# EAGLE design relay_module (EAGLE 6.3)
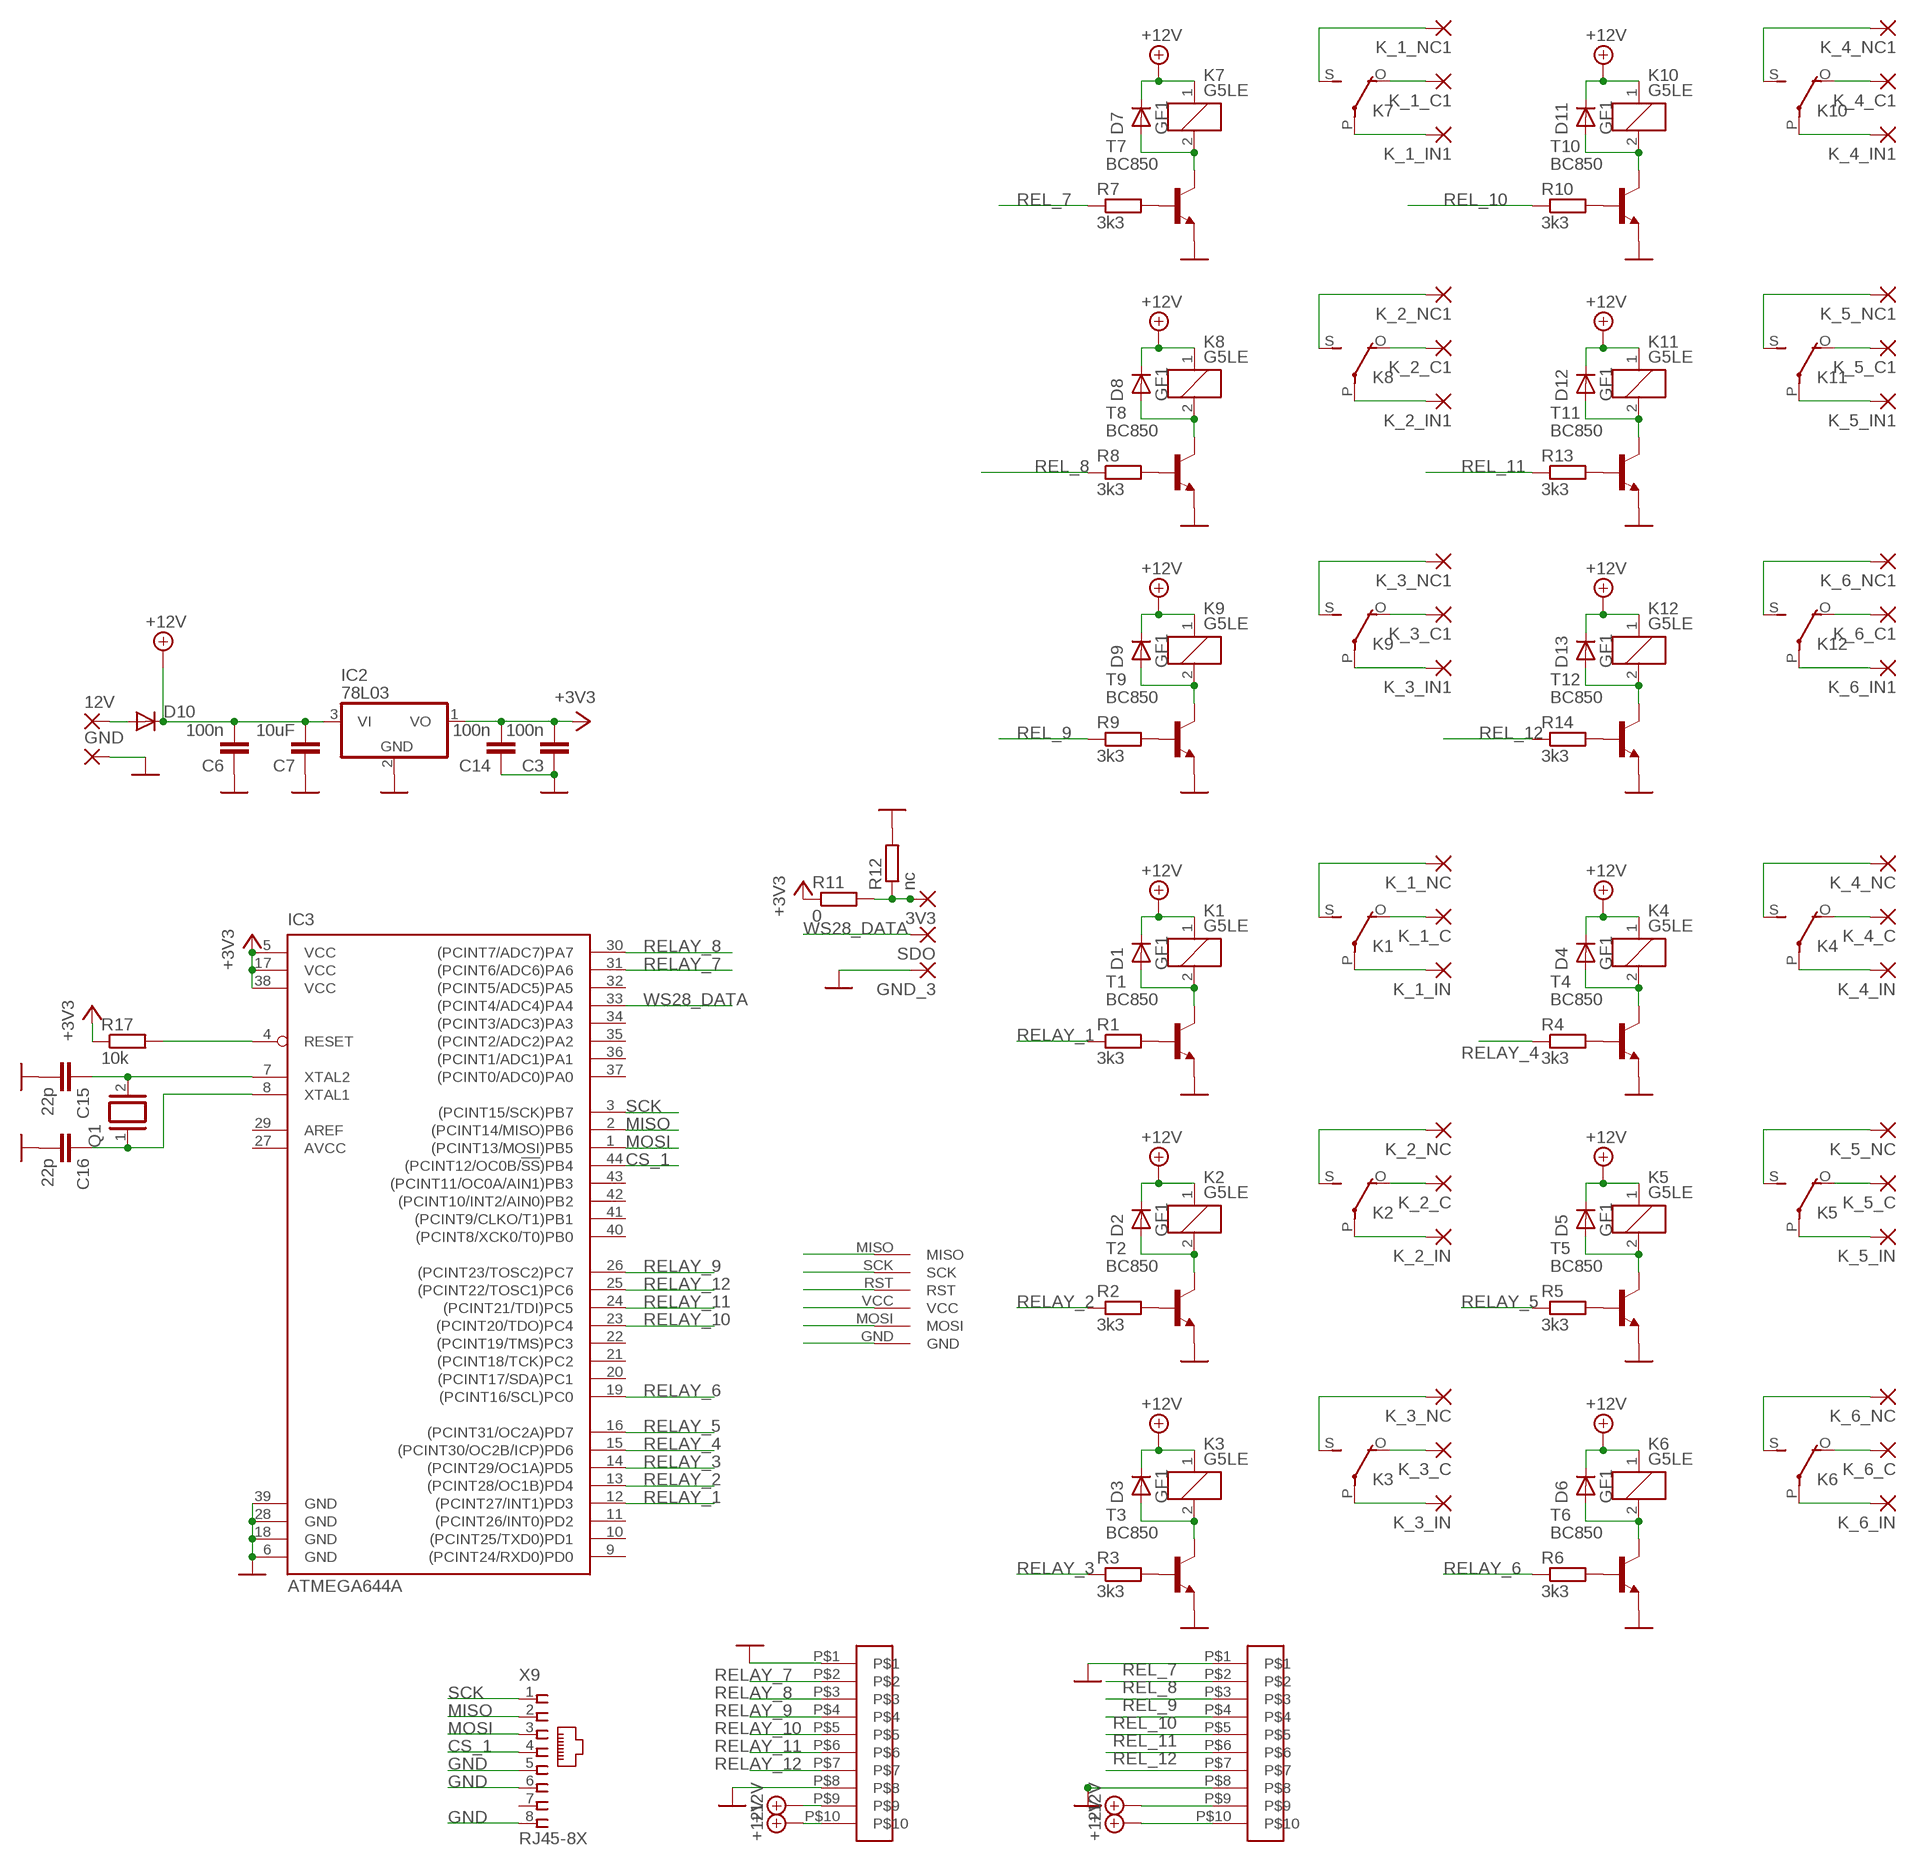
[diagram p0: schematic, sheet 1]

## Parts
3V3  2,15/1,0  [2,15/1,0]
12V  2,54/0,8  [2,54/0,8]
C3  100n  C-EUC1206  [C1206]
C6  100n  C-EUC1206  [C1206]
C7  10uF  C-EUC1206  [C1206]
C14  100n  C-EUC1206  [C1206]
C15  22p  C-EUC1206  [C1206]
C16  22p  C-EUC1206  [C1206]
D1  GF1  [SMA-DO214AC]
D2  GF1  [SMA-DO214AC]
D3  GF1  [SMA-DO214AC]
D4  GF1  [SMA-DO214AC]
D5  GF1  [SMA-DO214AC]
D6  GF1  [SMA-DO214AC]
D7  GF1  [SMA-DO214AC]
D8  GF1  [SMA-DO214AC]
D9  GF1  [SMA-DO214AC]
D10  1N4148DO35-10  [DO35-10]
D11  GF1  [SMA-DO214AC]
D12  GF1  [SMA-DO214AC]
D13  GF1  [SMA-DO214AC]
GND  2,54/0,8  [2,54/0,8]
GND_3  2,15/1,0  [2,15/1,0]
IC2  78L03  78L05Z  [TO92]
IC3  ATMEGA644A  [TQFP44]
K1  G5LE  [G5LE]
K2  G5LE  [G5LE]
K3  G5LE  [G5LE]
K4  G5LE  [G5LE]
K5  G5LE  [G5LE]
K6  G5LE  [G5LE]
K7  G5LE  [G5LE]
K8  G5LE  [G5LE]
K9  G5LE  [G5LE]
K10  G5LE  [G5LE]
K11  G5LE  [G5LE]
K12  G5LE  [G5LE]
K_1_C  2,54/0,8  [2,54/0,8]
K_1_C1  2,54/0,8  [2,54/0,8]
K_1_IN  2,54/0,8  [2,54/0,8]
K_1_IN1  2,54/0,8  [2,54/0,8]
K_1_NC  2,54/0,8  [2,54/0,8]
K_1_NC1  2,54/0,8  [2,54/0,8]
K_2_C  2,54/0,8  [2,54/0,8]
K_2_C1  2,54/0,8  [2,54/0,8]
K_2_IN  2,54/0,8  [2,54/0,8]
K_2_IN1  2,54/0,8  [2,54/0,8]
K_2_NC  2,54/0,8  [2,54/0,8]
K_2_NC1  2,54/0,8  [2,54/0,8]
K_3_C  2,54/0,8  [2,54/0,8]
K_3_C1  2,54/0,8  [2,54/0,8]
K_3_IN  2,54/0,8  [2,54/0,8]
K_3_IN1  2,54/0,8  [2,54/0,8]
K_3_NC  2,54/0,8  [2,54/0,8]
K_3_NC1  2,54/0,8  [2,54/0,8]
K_4_C  2,54/0,8  [2,54/0,8]
K_4_C1  2,54/0,8  [2,54/0,8]
K_4_IN  2,54/0,8  [2,54/0,8]
K_4_IN1  2,54/0,8  [2,54/0,8]
K_4_NC  2,54/0,8  [2,54/0,8]
K_4_NC1  2,54/0,8  [2,54/0,8]
K_5_C  2,54/0,8  [2,54/0,8]
K_5_C1  2,54/0,8  [2,54/0,8]
K_5_IN  2,54/0,8  [2,54/0,8]
K_5_IN1  2,54/0,8  [2,54/0,8]
K_5_NC  2,54/0,8  [2,54/0,8]
K_5_NC1  2,54/0,8  [2,54/0,8]
K_6_C  2,54/0,8  [2,54/0,8]
K_6_C1  2,54/0,8  [2,54/0,8]
K_6_IN  2,54/0,8  [2,54/0,8]
K_6_IN1  2,54/0,8  [2,54/0,8]
K_6_NC  2,54/0,8  [2,54/0,8]
K_6_NC1  2,54/0,8  [2,54/0,8]
Q1  XTAL/S  [QS]
R1  3k3  R-EU_M3216  [M3216]
R2  3k3  R-EU_M3216  [M3216]
R3  3k3  R-EU_M3216  [M3216]
R4  3k3  R-EU_M3216  [M3216]
R5  3k3  R-EU_M3216  [M3216]
R6  3k3  R-EU_M3216  [M3216]
R7  3k3  R-EU_M3216  [M3216]
R8  3k3  R-EU_M3216  [M3216]
R9  3k3  R-EU_M3216  [M3216]
R10  3k3  R-EU_M3216  [M3216]
R11  0  R-EU_M3216  [M3216]
R12  nc  R-EU_M3216  [M3216]
R13  3k3  R-EU_M3216  [M3216]
R14  3k3  R-EU_M3216  [M3216]
R17  10k  R-EU_M3216  [M3216]
SDO  2,15/1,0  [2,15/1,0]
T1  BC850  [SOT23]
T2  BC850  [SOT23]
T3  BC850  [SOT23]
T4  BC850  [SOT23]
T5  BC850  [SOT23]
T6  BC850  [SOT23]
T7  BC850  [SOT23]
T8  BC850  [SOT23]
T9  BC850  [SOT23]
T10  BC850  [SOT23]
T11  BC850  [SOT23]
T12  BC850  [SOT23]
U$1  10P  [10P]
U$2  AVR_ISP  [AVR_ISP]
U$3  10P  [10P]
X9  RJ45-8X  [RJ45-NO-SHIELD]

## Nets
+3V3: C3.2 C14.2 IC2.1(VO) IC3.5(VCC) IC3.17(VCC) IC3.38(VCC) R11.1 R17.1 U$2.VCC
+12V: C6.2 C7.2 D1.K(C) D2.K(C) D3.K(C) D4.K(C) D5.K(C) D6.K(C) D7.K(C) D8.K(C) D9.K(C) D10.C D11.K(C) D12.K(C) D13.K(C) IC2.3(VI) K1.1 K2.1 K3.1 K4.1 K5.1 K6.1 K7.1 K8.1 K9.1 K10.1 K11.1 K12.1 U$1.P$9 U$1.P$10 U$3.P$9 U$3.P$10
CS_1: IC3.44((PCINT12/OC0B/!SS!)PB4) X9.4
GND: C3.1 C6.1 C7.1 C14.1 C15.2 C16.2 GND.1(P) GND_3.1(P) IC2.2(GND) IC3.6(GND) IC3.18(GND) IC3.28(GND) IC3.39(GND) R12.2 T1.2(E) T2.2(E) T3.2(E) T4.2(E) T5.2(E) T6.2(E) T7.2(E) T8.2(E) T9.2(E) T10.2(E) T11.2(E) T12.2(E) U$1.P$1 U$1.P$8 U$2.GND U$3.P$1 U$3.P$8 X9.5 X9.6 X9.8
MISO: IC3.2((PCINT14/MISO)PB6) U$2.MISO X9.2
MOSI: IC3.1((PCINT13/MOSI)PB5) U$2.MOSI X9.3
N$1: R1.2 T1.1(B)
N$2: D1.A K1.2 T1.3(C)
N$3: K1.S(2:S) K_1_NC.1(P)
N$4: K1.P(2:P) K_1_IN.1(P)
N$5: K1.O(2:O) K_1_C.1(P)
N$6: R2.2 T2.1(B)
N$7: D2.A K2.2 T2.3(C)
N$8: K2.P(2:P) K_2_IN.1(P)
N$9: K2.O(2:O) K_2_C.1(P)
N$10: K2.S(2:S) K_2_NC.1(P)
N$11: R3.2 T3.1(B)
N$12: D3.A K3.2 T3.3(C)
N$13: K3.P(2:P) K_3_IN.1(P)
N$14: K3.O(2:O) K_3_C.1(P)
N$15: K3.S(2:S) K_3_NC.1(P)
N$16: R4.2 T4.1(B)
N$17: D4.A K4.2 T4.3(C)
N$18: K4.P(2:P) K_4_IN.1(P)
N$19: K4.O(2:O) K_4_C.1(P)
N$20: K4.S(2:S) K_4_NC.1(P)
N$21: R5.2 T5.1(B)
N$22: D5.A K5.2 T5.3(C)
N$23: K5.P(2:P) K_5_IN.1(P)
N$24: K5.O(2:O) K_5_C.1(P)
N$25: K5.S(2:S) K_5_NC.1(P)
N$26: R6.2 T6.1(B)
N$27: D6.A K6.2 T6.3(C)
N$28: K6.P(2:P) K_6_IN.1(P)
N$29: K6.O(2:O) K_6_C.1(P)
N$30: K6.S(2:S) K_6_NC.1(P)
N$35: R7.2 T7.1(B)
N$36: D7.A K7.2 T7.3(C)
N$37: K7.P(2:P) K_1_IN1.1(P)
N$38: K7.O(2:O) K_1_C1.1(P)
N$39: K7.S(2:S) K_1_NC1.1(P)
N$40: R8.2 T8.1(B)
N$41: D8.A K8.2 T8.3(C)
N$42: K8.P(2:P) K_2_IN1.1(P)
N$43: K8.O(2:O) K_2_C1.1(P)
N$44: K8.S(2:S) K_2_NC1.1(P)
N$45: R9.2 T9.1(B)
N$46: D9.A K9.2 T9.3(C)
N$47: K9.P(2:P) K_3_IN1.1(P)
N$48: K9.O(2:O) K_3_C1.1(P)
N$49: K9.S(2:S) K_3_NC1.1(P)
N$50: 3V3.1(P) R11.2 R12.1
N$51: R10.2 T10.1(B)
N$52: D11.A K10.2 T10.3(C)
N$53: K10.P(2:P) K_4_IN1.1(P)
N$54: 12V.1(P) D10.A
N$55: K10.O(2:O) K_4_C1.1(P)
N$56: K10.S(2:S) K_4_NC1.1(P)
N$57: R13.2 T11.1(B)
N$58: D12.A K11.2 T11.3(C)
N$59: K11.P(2:P) K_5_IN1.1(P)
N$60: K11.O(2:O) K_5_C1.1(P)
N$61: C15.1 IC3.7(XTAL2) Q1.2
N$62: K11.S(2:S) K_5_NC1.1(P)
N$63: R14.2 T12.1(B)
N$64: D13.A K12.2 T12.3(C)
N$65: K12.P(2:P) K_6_IN1.1(P)
N$66: K12.O(2:O) K_6_C1.1(P)
N$67: K12.S(2:S) K_6_NC1.1(P)
N$79: C16.1 IC3.8(XTAL1) Q1.1
REL_7: R7.1 U$3.P$2
REL_8: R8.1 U$3.P$3
REL_9: R9.1 U$3.P$4
REL_10: R10.1 U$3.P$5
REL_11: R13.1 U$3.P$6
REL_12: R14.1 U$3.P$7
RELAY_1: IC3.12((PCINT27/INT1)PD3) R1.1
RELAY_2: IC3.13((PCINT28/OC1B)PD4) R2.1
RELAY_3: IC3.14((PCINT29/OC1A)PD5) R3.1
RELAY_4: IC3.15((PCINT30/OC2B/ICP)PD6) R4.1
RELAY_5: IC3.16((PCINT31/OC2A)PD7) R5.1
RELAY_6: IC3.19((PCINT16/SCL)PC0) R6.1
RELAY_7: IC3.31((PCINT6/ADC6)PA6) U$1.P$2
RELAY_8: IC3.30((PCINT7/ADC7)PA7) U$1.P$3
RELAY_9: IC3.26((PCINT23/TOSC2)PC7) U$1.P$4
RELAY_10: IC3.23((PCINT20/TDO)PC4) U$1.P$5
RELAY_11: IC3.24((PCINT21/TDI)PC5) U$1.P$6
RELAY_12: IC3.25((PCINT22/TOSC1)PC6) U$1.P$7
RESET: IC3.4(RESET) R17.2 U$2.RST
SCK: IC3.3((PCINT15/SCK)PB7) U$2.SCK X9.1
WS28_DATA: IC3.33((PCINT4/ADC4)PA4) SDO.1(P)
Unconnected: IC3.9((PCINT24/RXD0)PD0) IC3.10((PCINT25/TXD0)PD1) IC3.11((PCINT26/INT0)PD2) IC3.20((PCINT17/SDA)PC1) IC3.21((PCINT18/TCK)PC2) IC3.22((PCINT19/TMS)PC3) IC3.29(AREF) IC3.32((PCINT5/ADC5)PA5) IC3.34((PCINT3/ADC3)PA3) IC3.35((PCINT2/ADC2)PA2) IC3.36((PCINT1/ADC1)PA1) IC3.37((PCINT0/ADC0)PA0) IC3.40((PCINT8/XCK0/T0)PB0) IC3.41((PCINT9/CLKO/T1)PB1) IC3.42((PCINT10/INT2/AIN0)PB2) IC3.43((PCINT11/OC0A/AIN1)PB3) X9.7

## Power pins joined to a net without a drawn wire
AVCC: IC3.27(AVCC)

## Library data of the parts
3V3 GND_3 SDO = wirepad:2,15/1,0: THROUGH-HOLE PAD
12V GND K_1_C K_1_C1 K_1_IN K_1_IN1 K_1_NC K_1_NC1 K_2_C K_2_C1 K_2_IN K_2_IN1 K_2_NC K_2_NC1 K_3_C K_3_C1 K_3_IN K_3_IN1 K_3_NC K_3_NC1 K_4_C K_4_C1 K_4_IN K_4_IN1 K_4_NC K_4_NC1 K_5_C K_5_C1 K_5_IN K_5_IN1 K_5_NC K_5_NC1 K_6_C K_6_C1 K_6_IN K_6_IN1 K_6_NC K_6_NC1 = wirepad:2,54/0,8: THROUGH-HOLE PAD
C3 C6 C7 C14-C16 = resistor:C-EU: CAPACITOR, European symbol
D1-D9 D11-D13 = diode:GF1: DIODE
D10 = diode:1N4148: DIODE high speed (Philips)
IC2 = linear:78*: Positive VOLTAGE REGULATOR Source: http://cache.national.com/ds/LM/LM78L05.pdf http://www.fairchildsemi.com/ds/LM/LM7805.pdf
IC3 = atmel:ATMEGA644: 8-bit Microcontroller with 64K Bytes In-System Programmable Flash Source: http://www.atmel.com/dyn/resources/prod_documents/doc2593.pdf; MPN: ATMEGA644PV-10AU; OC_FARNELL: 1455123; OC_NEWARK: 58M3748
K1-K12 = relay:G5LE: RELAY 1 x switch, 10 A/120 V AC, 8 A/30 V DC, Omron; OC_FARNELL: unknown; OC_NEWARK: unknown
Q1 = special:XTAL/S: CRYSTAL
R1-R14 R17 = rcl:R-EU_: RESISTOR, European symbol
T1-T12 = transistor:BC850: NPN TRANSISTOR
U$1 U$3 = 2 - csatlakozo:10P
U$2 = 2 - csatlakozo:AVR_ISP
X9 = con-tycoelectronics:RJ45: CORCOM Modular RJ Jacks No Shield Source: www.tycoelectronics.com .. ENG_DS_1654001_1099_RJ_L_0507.pdf; MPN: RJ45-8X; OC_FARNELL: unknown; OC_NEWARK: 16R6101

## Net classes
0 default: clearance 0.355 mm

## Board
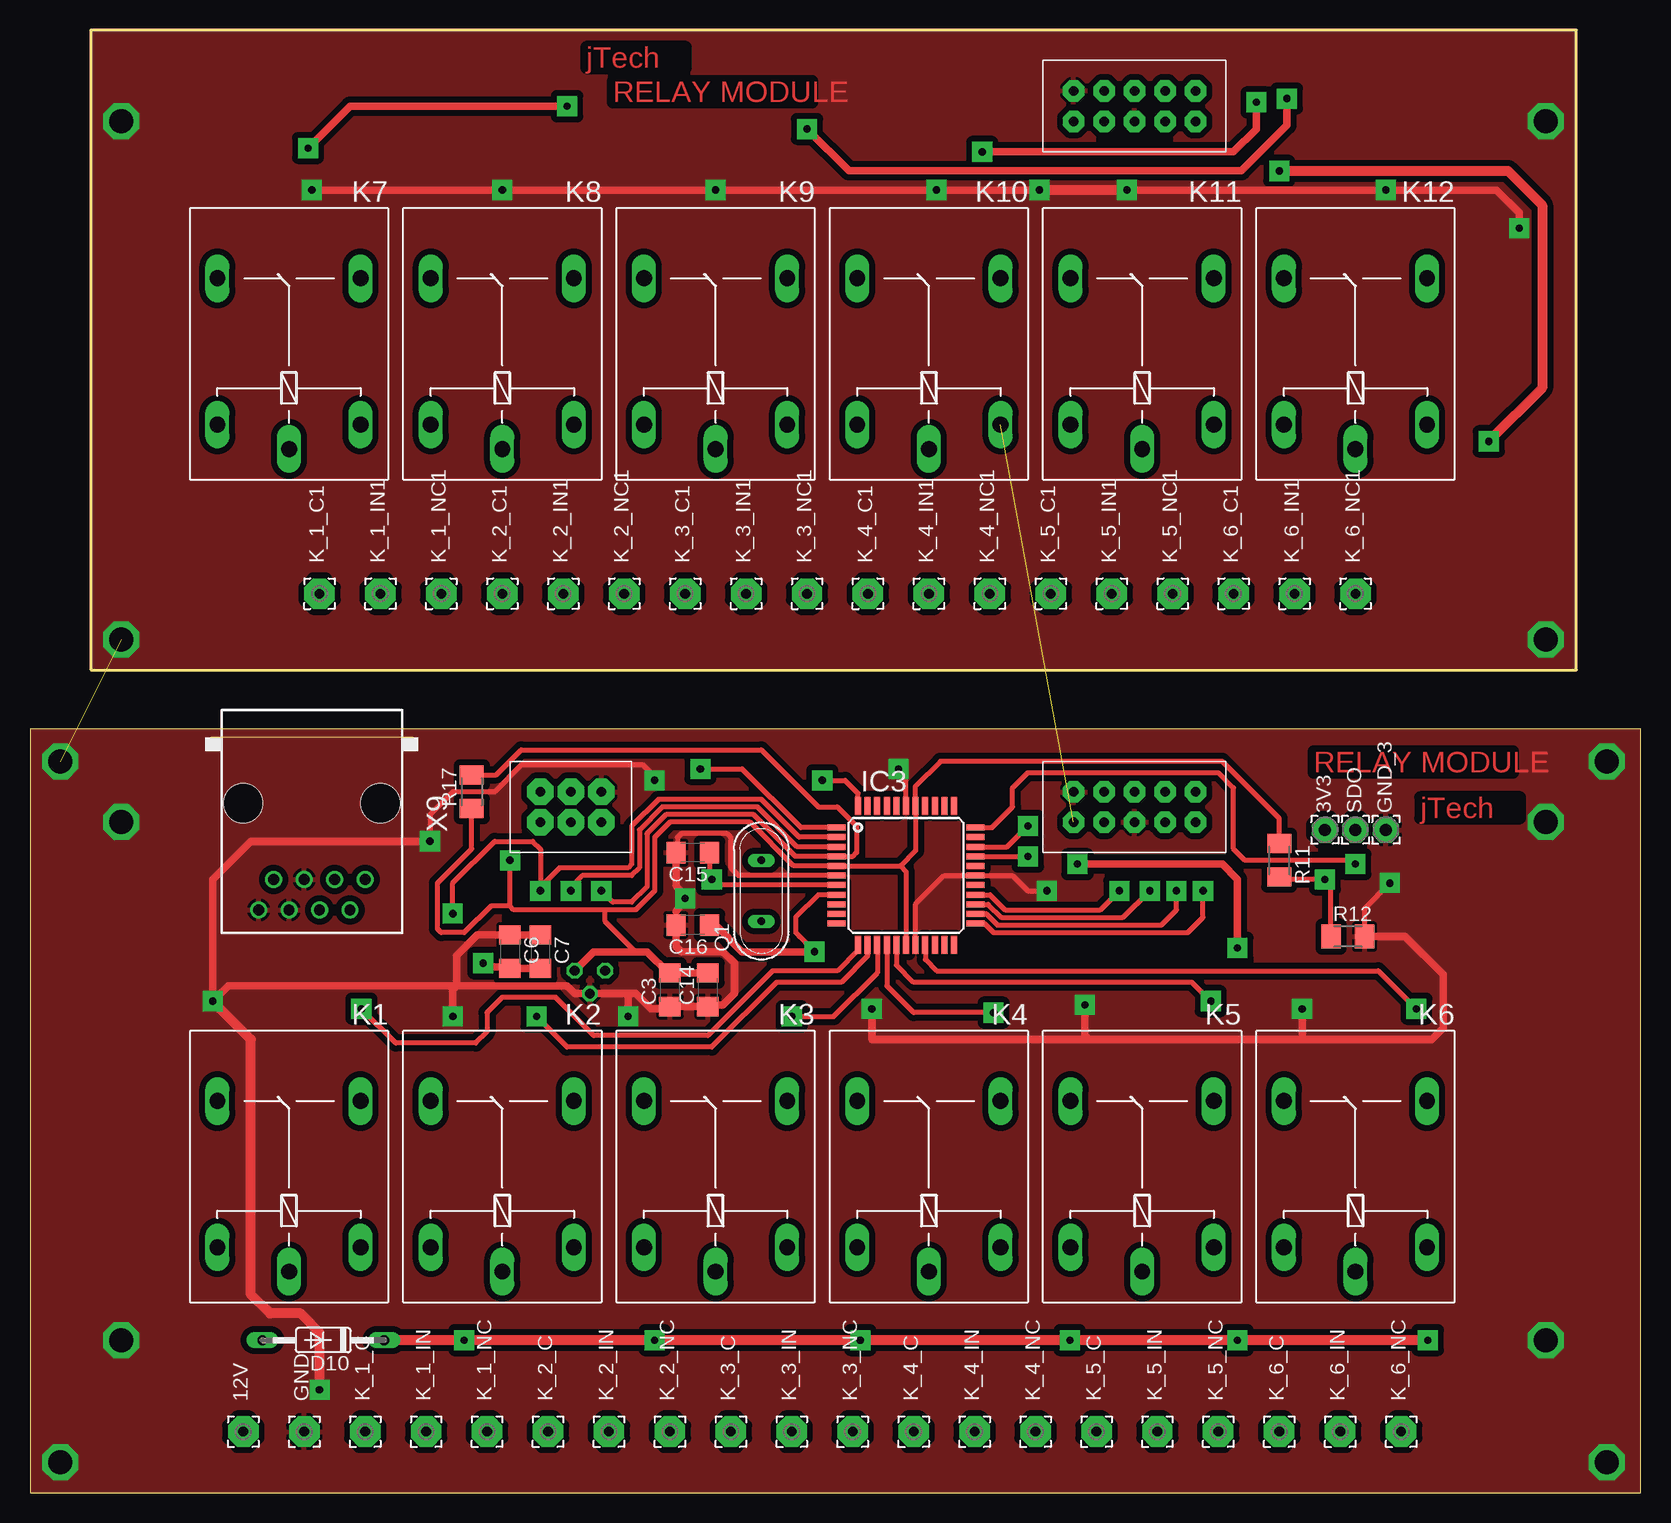
[diagram p1: board, top side]
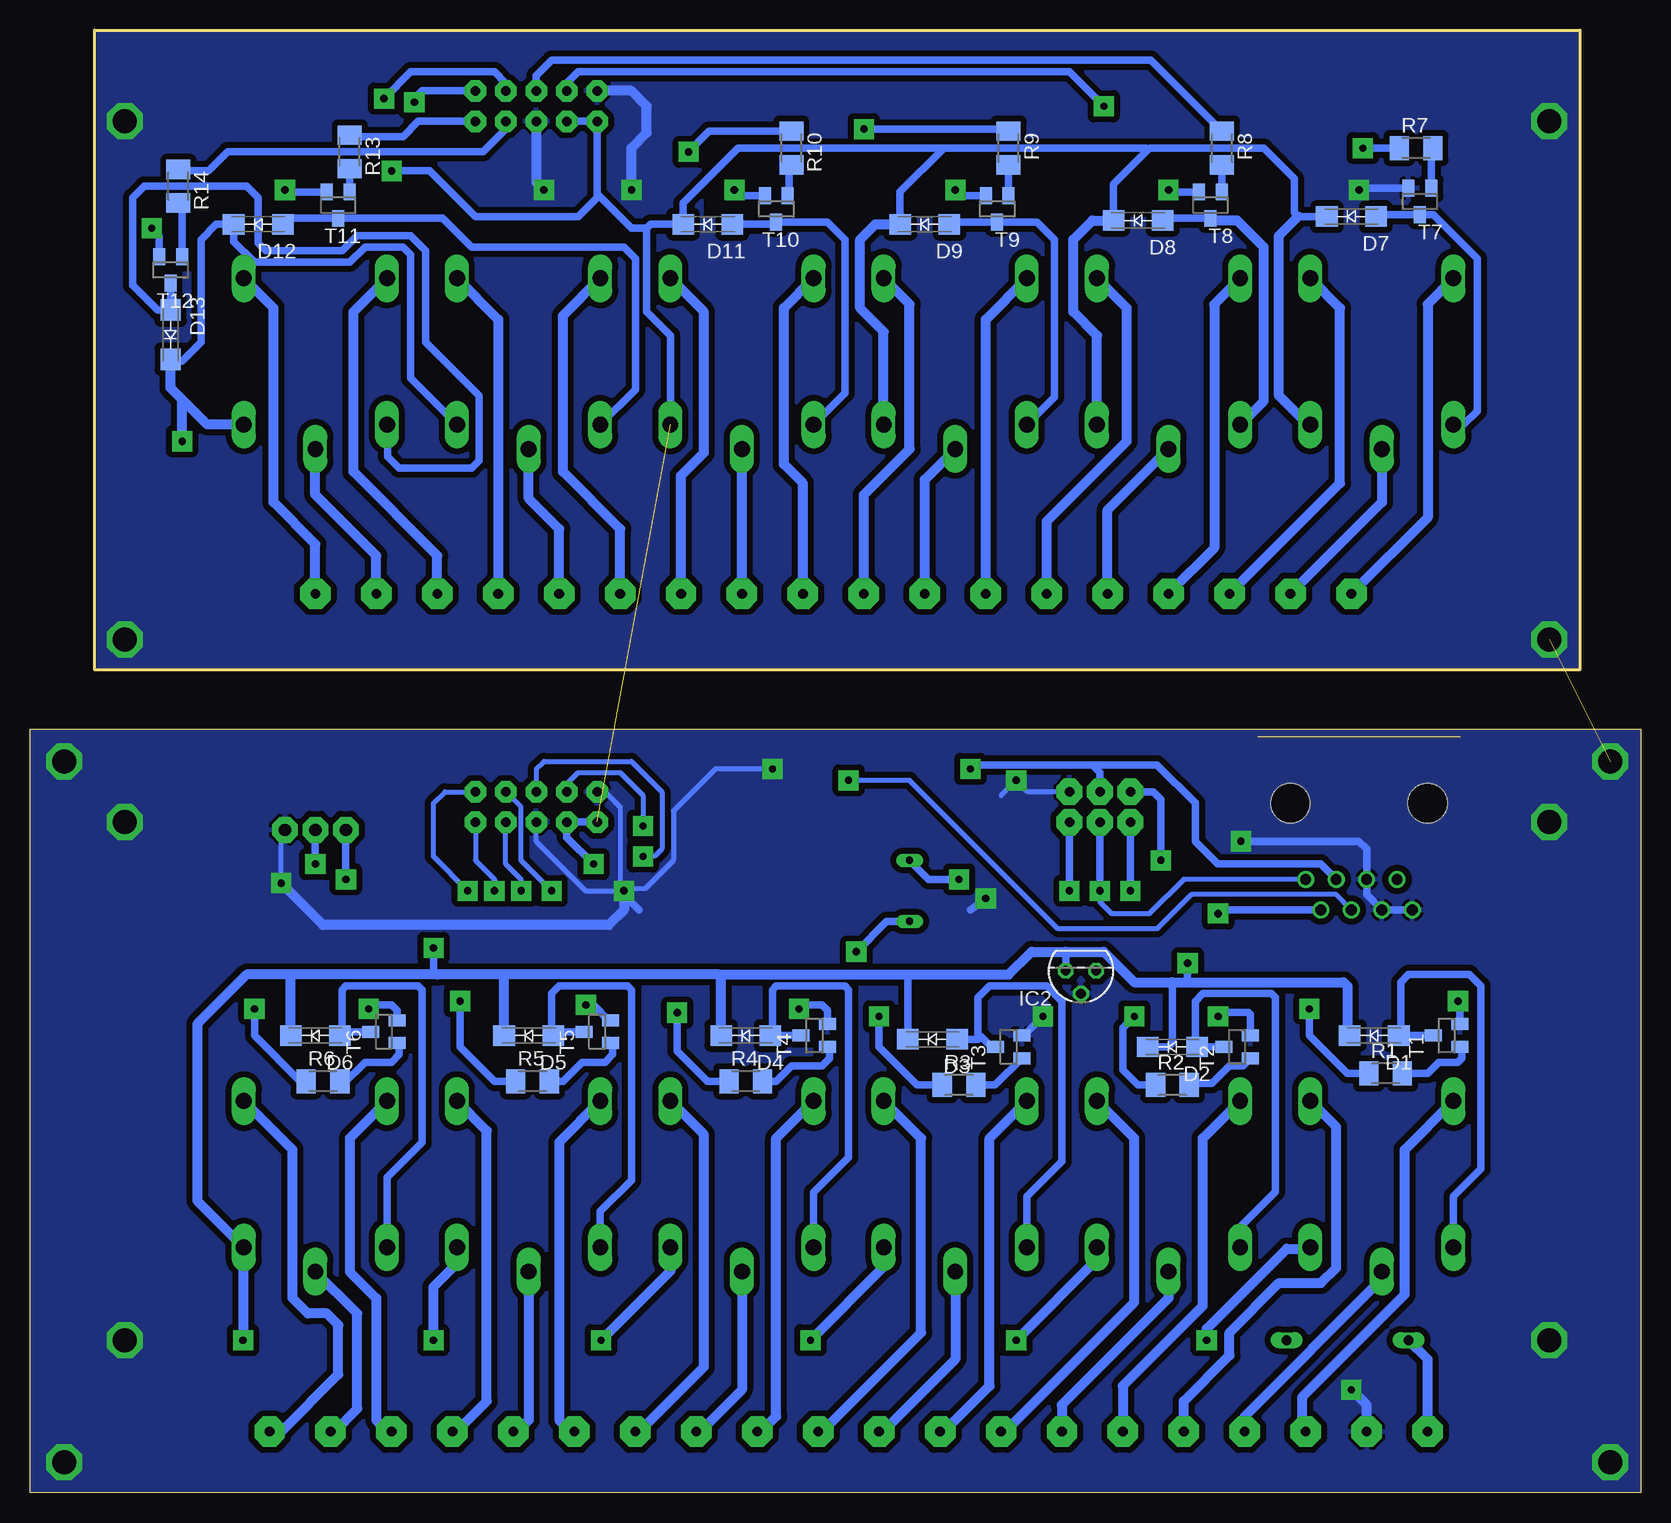
[diagram p2: board, bottom side, seen from below]

Size 134.28 x 121.92 mm. Coordinates in mm from the lower left corner, seen from the top.
Outline: 0,0 134.28,0 134.28,63.65 0,63.65 0,0
Outline: 5.08,68.58 128.91,68.58 128.91,121.92 5.08,121.92 5.08,68.58
Copper layers (1*16): Top 0.035mm / dielectric 1.5mm / Bottom 0.035mm
Design rules "default *": minimum track width 10mil, minimum drill 24mil, track to track 20mil, track to pad 20mil, pad to pad 20mil, via to via 20mil, smd to smd 20mil, copper to edge 1mil, drill to drill 8mil, minimum pad ring 10mil, minimum via ring 8mil, stop-mask expansion 4mil, vias tented up to drill 0mil, thermal gap 10mil
tRestrict: area 39.4,43.8 to 48.3,48.6; area 88.9,111.8 to 95.3,114.9
bRestrict: area 101.9,38.7 to 108.3,41.9; area 84.8,38.7 to 91.4,41.9; area 66.4,38.7 to 72.4,41.9; area 30.2,37.8 to 36.5,41.6; area 13.7,38.7 to 19.1,42.5; area 34,106.4 to 78.1,111.4; area 108.6,106.7 to 118.1,111.4; area 121.6,99.7 to 125.1,108.6

### Footprints (pad centres in the part's own frame; a part is rotated, then mirrored left to right if it is on the bottom)
2,15/1,0 = drill 1.016 pad 2.159 octagon: 1 0,0
2,54/0,8 = drill 0.813 pad 2.54 octagon: 1 0,0
C1206 = smd 1.6 x 1.8: 1 -1.4,0; 2 1.4,0
SMA-DO214AC = smd 1.8 x 1.7: A -2.05,0; K 2.05,0
DO35-10 = drill 0.813 long: A 5.08,0; C -5.08,0
TO92 = drill 0.813 octagon: 1 -1.27,0; 2 0,1.905; 3 1.27,0
TQFP44 = smd 1.5 x 0.5: 1 -5.8,4; 2 -5.8,3.2; 3 -5.8,2.4; 4 -5.8,1.6; 5 -5.8,0.8; 6 -5.8,0; 7 -5.8,-0.8; 8 -5.8,-1.6; 9 -5.8,-2.4; 10 -5.8,-3.2; 11 -5.8,-4; 23 5.8,-4; 24 5.8,-3.2; 25 5.8,-2.4; 26 5.8,-1.6; 27 5.8,-0.8; 28 5.8,0; 29 5.8,0.8; 30 5.8,1.6; 31 5.8,2.4; 32 5.8,3.2; 33 5.8,4 | smd 0.5 x 1.5: 12 -4,-5.8; 13 -3.2,-5.8; 14 -2.4,-5.8; 15 -1.6,-5.8; 16 -0.8,-5.8; 17 0,-5.8; 18 0.8,-5.8; 19 1.6,-5.8; 20 2.4,-5.8; 21 3.2,-5.8; 22 4,-5.8; 34 4,5.8; 35 3.2,5.8; 36 2.4,5.8; 37 1.6,5.8; 38 0.8,5.8; 39 0,5.8; 40 -0.8,5.8; 41 -1.6,5.8; 42 -2.4,5.8; 43 -3.2,5.8; 44 -4,5.8
G5LE = drill 1.321 long: 1 -7.493,-5.969; 2 -7.493,5.969; O 4.699,5.969; P -9.525,0; S 4.699,-5.969
QS = drill 0.61 long: 1 -2.54,0; 2 2.54,0
M3216 = smd 1.6 x 2: 1 -1.4,0; 2 1.4,0
SOT23 = smd 1 x 1.4: 1 -0.95,-1.1; 2 0.95,-1.1; 3 0,1.1
10P = drill 0.8 pad 1.778 octagon: P$1 -5.08,0; P$2 -2.54,0; P$3 0,0; P$4 2.54,0; P$5 5.08,0; P$6 5.08,-2.54; P$7 2.54,-2.54; P$8 0,-2.54; P$9 -2.54,-2.54; P$10 -5.08,-2.54
AVR_ISP = drill 0.8 pad 2.184 octagon: GND 0,-2.54; MISO -2.54,2.54; MOSI 0,0; RST -2.54,-2.54; SCK -2.54,0; VCC 0,2.54
RJ45-NO-SHIELD = drill 0.9 pad 1.4: 1 -4.445,6.35; 2 -3.175,8.89; 3 -1.905,6.35; 4 -0.635,8.89; 5 0.635,6.35; 6 1.905,8.89; 7 3.175,6.35; 8 4.445,8.89 | hole 3.251: -5.715,0; 5.715,0

### Placement (x,y rotation side)
3V3  107.95,55.24 0 top
12V  17.78,5.08 90 top
C3  53.34,41.91 90 top
C6  40.01,45.09 270 top
C7  42.55,45.09 270 top
C14  56.52,41.91 90 top
C15  55.24,53.34 180 top
C16  55.24,47.31 180 top
D1  22.23,38.1 180 bottom
D2  39.05,37.15 180 bottom
D3  59.05,37.78 180 bottom
D4  74.61,38.1 180 bottom
D5  92.71,38.1 180 bottom
D6  110.49,38.1 180 bottom
D7  24.13,106.36 180 bottom
D8  41.91,106.05 180 bottom
D9  59.69,105.73 180 bottom
D10  24.45,12.7 180 top
D11  77.79,105.73 180 bottom
D12  115.25,105.73 180 bottom
D13  122.55,96.52 270 bottom
GND  22.86,5.08 90 top
GND_3  113.03,55.24 0 top
IC2  46.67,43.5 180 bottom
IC3  73.02,51.44 0 top
K1  21.59,27.94 90 top
K2  39.37,27.94 90 top
K3  57.15,27.94 90 top
K4  74.93,27.94 90 top
K5  92.71,27.94 90 top
K6  110.49,27.94 90 top
K7  21.59,96.52 90 top
K8  39.37,96.52 90 top
K9  57.15,96.52 90 top
K10  74.93,96.52 90 top
K11  92.71,96.52 90 top
K12  110.49,96.52 90 top
K_1_C  27.94,5.08 90 top
K_1_C1  24.13,74.93 90 top
K_1_IN  33.02,5.08 90 top
K_1_IN1  29.21,74.93 90 top
K_1_NC  38.1,5.08 90 top
K_1_NC1  34.29,74.93 90 top
K_2_C  43.18,5.08 90 top
K_2_C1  39.37,74.93 90 top
K_2_IN  48.26,5.08 90 top
K_2_IN1  44.45,74.93 90 top
K_2_NC  53.34,5.08 90 top
K_2_NC1  49.53,74.93 90 top
K_3_C  58.42,5.08 90 top
K_3_C1  54.61,74.93 90 top
K_3_IN  63.5,5.08 90 top
K_3_IN1  59.69,74.93 90 top
K_3_NC  68.58,5.08 90 top
K_3_NC1  64.77,74.93 90 top
K_4_C  73.66,5.08 90 top
K_4_C1  69.85,74.93 90 top
K_4_IN  78.74,5.08 90 top
K_4_IN1  74.93,74.93 90 top
K_4_NC  83.82,5.08 90 top
K_4_NC1  80.01,74.93 90 top
K_5_C  88.9,5.08 90 top
K_5_C1  85.09,74.93 90 top
K_5_IN  93.98,5.08 90 top
K_5_IN1  90.17,74.93 90 top
K_5_NC  99.06,5.08 90 top
K_5_NC1  95.25,74.93 90 top
K_6_C  104.14,5.08 90 top
K_6_C1  100.33,74.93 90 top
K_6_IN  109.22,5.08 90 top
K_6_IN1  105.41,74.93 90 top
K_6_NC  114.3,5.08 90 top
K_6_NC1  110.49,74.93 90 top
Q1  60.96,50.16 90 top
R1  21.27,34.92 0 bottom
R2  39.05,33.97 0 bottom
R3  56.83,33.97 0 bottom
R4  74.61,34.29 0 bottom
R5  92.39,34.29 0 bottom
R6  109.85,34.29 0 bottom
R7  18.73,112.08 0 bottom
R8  34.93,112.08 270 bottom
R9  52.7,112.08 270 bottom
R10  70.8,112.08 270 bottom
R11  104.14,52.7 270 top
R12  109.85,46.35 0 top
R13  107.63,111.76 270 bottom
R14  121.92,108.9 270 bottom
R17  36.83,58.42 90 top
SDO  110.49,55.24 0 top
T1  16.19,38.1 90 bottom
T2  33.66,37.15 90 bottom
T3  52.7,37.15 90 bottom
T4  68.9,38.1 90 bottom
T5  86.99,38.42 90 bottom
T6  104.77,38.42 90 bottom
T7  18.41,107.63 180 bottom
T8  35.88,107.32 180 bottom
T9  53.66,107 180 bottom
T10  72.07,107 180 bottom
T11  108.58,107.32 180 bottom
T12  122.55,101.92 180 bottom
U$1  92.07,58.42 0 top
U$2  45.09,58.42 90 top
U$3  92.07,116.84 0 top
X9  23.5,57.47 180 top

### Tracks (layer width: path | path; a pad name or v marks a point on that pad's centre or on a via)
+3V3  (via drill 0.6 pad 1.68)
  Top 0.406: R11.1 104.14,56.2 99.38,60.96 75.88,60.96 73.82,58.9 IC3.38 73.82,53.52 72.54,52.23 | 47.94,48.58 50.48,48.58 52.07,50.16 52.07,54.61 53.34,55.88 60.01,55.88 63.65,52.23 IC3.5 72.54,52.23 | 47.94,48.58 40.32,48.58 40.01,48.89 | 40.01,48.89 v40.01,52.7 | 40.01,48.89 38.42,48.89 36.2,46.67 34.29,46.67 33.97,46.99 33.97,50.8 36.83,53.66 R17.1 | 72.54,52.23 73.02,51.75 IC3.17 | 51.44,45.09 50.48,45.09 47.94,47.62 47.94,48.58
  Top 0.61: C14.2 C3.2 53.21,43.31 51.44,45.09 46.99,45.09 IC2.1
  Bottom 0.61: v40.01,52.7 40.01,57.78 40.64,58.42 U$2.VCC
+12V  (via drill 0.6 pad 1.68)  (1 unrouted)
  Top 0.61: v87.31,52.39 99.38,52.39 100.65,51.12 v100.65,45.4 | C7.2 C6.2 39.88,43.81 38.42,43.81 38.1,44.13 v37.78,44.13
  Top 0.813: v116.52,12.7 v100.65,12.7 v86.68,12.7 v69.21,12.7 v52.07,12.7 v36.2,12.7 D10.C | v121.6,87.63 126.05,92.08 126.05,107.32 123.19,110.17 v104.14,110.17
  Bottom 0.61: v87.31,52.39 89.53,54.61 U$1.P$9 U$1.P$10 | IC2.3 47.94,45.09 | D3.K 61.11,43.03 60.96,43.18 | v100.65,45.4 100.65,43.5 100.33,43.18 | D2.K 39.37,37.15 39.05,37.46 39.05,42.55 | v37.78,44.13 37.78,42.55 | D13.K 122.38,94.3 121.6,94.3 120.02,95.89 120.02,104.46 118.74,105.73 D12.K 117.3,104.29 115.57,102.55 107.63,102.55 106.36,103.82 103.19,103.82 102.55,103.19 102.55,92.9 K11.1 | U$3.P$9 U$3.P$10 86.99,108.27 | D7.K 28.57,106.36 28.89,106.68 28.89,109.54 31.43,112.08 40.96,112.08 41.12,111.92 | D8.K 43.96,109.08 41.12,111.92 | D9.K 61.74,108.44 58.1,112.08 | 58.1,112.08 41.27,112.08 41.12,111.92 | 58.1,112.08 75.25,112.08 79.84,107.49 D11.K 82.55,105.73 82.87,105.41 | K10.1 80.9,96.46 82.87,98.43 82.87,105.41 | 86.99,108.27 84.14,105.41 82.87,105.41 | 86.99,108.27 86.99,107.95 88.58,106.36 97.15,106.36 100.96,110.17 v104.14,110.17
  Bottom 0.813: K2.1 45.34,19.43 v52.07,12.7 | K3.1 63.12,18.8 v69.21,12.7 | K4.1 80.9,18.48 v86.68,12.7 | K5.1 98.68,19.11 100.65,17.14 v100.65,12.7 | D4.K 76.66,43.01 76.83,43.18 | 76.83,43.18 94.93,43.18 | 94.93,43.18 100.33,43.18 112.39,43.18 | 112.39,43.18 116.2,43.18 120.33,39.05 120.33,24.32 K6.1 116.52,20.38 v116.52,12.7 | 76.83,43.18 60.96,43.18 52.7,43.18 50.8,45.09 47.94,45.09 44.77,45.09 42.23,42.55 39.05,42.55 37.78,42.55 24.77,42.55 24.45,42.23 24.45,38.27 D1.K | D5.K 94.76,43.01 94.93,43.18 | D6.K 112.54,43.03 112.39,43.18 | K7.1 27.75,89.03 30.16,91.44 30.16,104.78 28.57,106.36 | K8.1 45.34,96.46 47.31,98.43 47.31,104.46 45.72,106.05 D8.K | K9.1 63.12,96.77 65.09,98.74 65.09,104.46 63.82,105.73 D9.K | K12.1 119.51,89.03 121.6,91.12 | 121.6,91.12 122.55,92.08 D13.K | v121.6,87.63 121.6,91.12 | v36.2,12.7 36.2,13.65 29.53,20.32 27.69,20.32 K1.1
CS_1  (via drill 0.6 pad 1.68)
  Top 0.406: v66.04,59.37 67.94,59.37 69.02,58.29 IC3.44
  Bottom 0.406: X9.4 25.4,49.85 37.47,49.85 40.32,46.99 48.58,46.99 60.96,59.37 v66.04,59.37
GND  (via drill 0.6 pad 1.68, 2 pad 2.54)  (1 unrouted)
  Top 0.406: R12.2 111.25,48.71 v113.35,50.8 | v84.77,50.16 83.18,50.16 81.91,51.44 IC3.28 76.2,51.44 73.82,49.06 IC3.18 | IC3.6 59.05,51.44 58.42,52.07 58.42,54.61 58.1,54.93 54.29,54.93 53.98,54.61 53.98,53.47 | v52.07,59.37 52.07,59.69 51.12,60.64 40.96,60.64 38.73,58.42 35.24,58.42 33.34,56.52 v33.34,54.29 | IC3.39 73.02,59.69 v72.39,60.32
  Top 0.61: v15.24,40.96 15.24,51.12 18.41,54.29 v33.34,54.29 | 15.88,41.59 v15.24,40.96 | 49.85,41.59 IC2.2 45.4,41.59 44.77,42.23 35.56,42.23 | 49.85,41.59 50.48,41.59 51.75,40.32 53.15,40.32 C3.1 C14.1 56.65,40.64 57.79,40.64 58.74,41.59 58.74,44.13 57.79,45.09 54.29,45.09 53.84,45.53 C16.2 | v49.85,39.69 49.85,41.59 | v70.17,40.32 70.17,37.78 88.27,37.78 | 111.12,46.23 R12.2 114.62,46.35 117.79,43.18 117.79,38.73 116.84,37.78 106.04,37.78 | 88.27,37.78 106.04,37.78 | v106.04,40.32 106.04,37.78 | v87.95,40.64 87.95,38.1 88.27,37.78 | 35.56,42.23 16.51,42.23 v15.24,40.96 | v35.24,39.69 35.24,41.91 35.56,42.23 | 35.56,42.23 35.56,44.77 37.28,46.48 C6.1 C7.1 | 53.84,48.45 v54.61,49.53 53.84,50.61 C15.2 53.98,53.47 | v124.14,105.41 124.14,106.68 122.24,108.59 v113.03,108.59 v91.44,108.59 | v84.14,108.59 v75.56,108.59 v57.15,108.59 v39.37,108.59 v23.5,108.59
  Top 0.813: v24.13,8.57 24.13,13.34 22.54,14.92 20,14.92 18.41,16.51 18.41,37.78 v15.24,40.96 | v91.44,108.59 v84.14,108.59
  Bottom 0.406: v113.35,50.8 113.35,54.93 GND_3.1 | v84.77,50.16 85.09,50.48 85.09,57.15 86.36,58.42 U$1.P$1 | v84.77,50.16 87.95,50.16 92.07,54.29 U$1.P$8 | U$2.GND 51.12,58.42 v52.07,59.37 53.34,58.1 | v84.77,50.16 84.61,50.32 83.03,50.32 80.64,52.7 80.64,56.83 77.15,60.32 v72.39,60.32 72.07,60.64
  Bottom 0.61: T1.2 15.09,40.81 v15.24,40.96 | T3.2 51.44,38.1 v49.85,39.69 | T5.2 86.04,39.37 87.31,40.64 v87.95,40.64 | T4.2 67.8,40.17 68.26,40.64 69.85,40.64 v70.17,40.32 | T6.2 103.67,40.17 104.14,40.64 105.73,40.64 v106.04,40.32 | T2.2 32.55,39.86 32.7,40.01 34.93,40.01 v35.24,39.69 | 84.77,49.85 83.5,48.58 | 55.88,48.58 v54.61,49.53 | T11.2 113.03,108.42 v113.03,108.59 | T12.2 123.5,104.77 v124.14,105.41 | T10.2 75.08,108.1 v75.56,108.59 | T9.2 56.66,108.1 v57.15,108.59 | T8.2 39.2,108.42 v39.37,108.59 | T7.2 23.35,108.73 v23.5,108.59 | X9.8 X9.6 22.86,49.85 X9.5 22.86,53.66 23.5,54.29 v33.34,54.29
  Bottom 0.813: GND.1 22.86,7.3 v24.13,8.57 | v84.77,50.16 84.77,49.85 84.77,48.58 86.04,47.31 109.85,47.31 v113.35,50.8 | U$3.P$8 92.07,109.22 | v84.14,108.59 84.14,112.08 82.87,113.35 82.87,115.57 84.14,116.84 U$3.P$1
  other vias: 131.45,2.54 131.45,60.96 2.54,60.96 2.54,2.54 126.36,114.3 7.62,55.88 126.36,55.88 126.36,12.7 7.62,12.7 7.62,71.12 126.36,71.12 7.62,114.3
  pour Top: 5.08,68.58 128.91,68.58 128.91,121.92 5.08,121.92
  pour Bottom: 5.08,121.92 128.91,121.92 128.91,68.58 5.08,68.58
  pour Bottom: 0,63.5 134.62,63.5 134.62,0 0,0
  pour Top: 0,63.5 134.62,63.5 134.62,0 0,0
MISO  (via drill 0.6 pad 1.68)
  Top 0.406: IC3.2 64.11,54.63 60.96,57.78 52.39,57.78 50.16,55.56 50.16,52.39 49.85,52.07 44.13,52.07 42.55,50.48 v42.55,50.16 42.55,53.66 41.91,54.29 38.73,54.29 35.24,50.8 v35.24,48.26
  Bottom 0.61: X9.2 34.93,48.58 v35.24,48.26 | v42.55,50.16 U$2.MISO
MOSI  (via drill 0.6 pad 1.68)
  Top 0.406: IC3.1 64.26,55.44 59.37,60.32 v55.88,60.32
  Bottom 0.61: v55.88,60.32 55.56,60.64 45.72,60.64 | 45.72,60.64 40.32,60.64 37.15,57.47 37.15,54.29 35.24,52.39 26.67,52.39 X9.3 | U$2.MOSI 45.09,60.01 45.72,60.64
N$1
  Bottom 0.61: T1.1 14.92,36.98 14.92,36.2 15.24,35.88 16.83,35.88 17.78,34.92 R1.2
N$2
  Bottom 0.61: K1.2 15.62,24.7 13.34,26.99 13.34,42.23 14.29,43.18 19.37,43.18 20,42.55 20,38.27 D1.A T1.3
N$3
  Bottom 0.813: K_1_NC.1 38.1,7.62 34.29,11.43 34.29,13.34 30.16,17.46 26.67,17.46 25.4,18.73 25.4,30.48 K1.S
N$4
  Bottom 0.813: K1.P 21.91,18.41 21.91,17.46 33.02,6.35 K_1_IN.1
N$5
  Bottom 0.813: K1.O 19.69,28.57 19.69,16.51 28.26,7.94 28.26,5.08 K_1_C.1
N$6
  Bottom 0.61: R2.2 37.52,34.1 35.75,34.1 34.29,35.56 33.19,35.56 T2.1
N$7
  Bottom 0.61: K2.2 33.4,22.16 30.48,25.08 30.48,41.27 30.8,41.59 36.51,41.59 37.15,40.96 37.15,37.29 D2.A T2.3
N$8
  Bottom 0.813: K2.P 39.37,16.19 48.26,7.3 K_2_IN.1
N$9
  Bottom 0.813: K2.O 36.51,29.53 36.51,15.56 43.18,8.89 K_2_C.1
N$10
  Bottom 0.813: K2.S 42.23,29.53 42.23,15.88 53.02,5.08 K_2_NC.1
N$11
  Bottom 0.61: T3.1 53.83,33.97 R3.2
N$12
  Bottom 0.61: K3.2 51.18,24.7 48.26,27.62 48.26,40.96 49.53,42.23 54.29,42.23 55.24,41.27 55.24,38.24 55.01,38.01 | T3.3 54.15,37.15 55.01,38.01 | D3.A 55.24,37.78 55.01,38.01
N$13
  Bottom 0.813: K3.P 57.15,11.11 63.18,5.08 K_3_IN.1
N$14
  Bottom 0.813: K3.O 54.29,29.53 54.29,8.89 57.79,5.4 58.1,5.4 K_3_C.1
N$15
  Bottom 0.813: K3.S 60.01,29.53 60.01,13.34 68.26,5.08 K_3_NC.1
N$16
  Bottom 0.61: T4.1 67.63,36.98 67.63,36.2 68.26,35.56 70.8,35.56 72.07,34.29 R4.2
N$17
  Bottom 0.61: K4.2 68.96,25.02 66.04,27.94 66.04,41.91 66.36,42.23 72.07,42.23 72.39,41.91 72.39,38.27 D4.A T4.3
N$18
  Bottom 0.813: K4.P 74.93,8.57 78.42,5.08 K_4_IN.1
N$19
  Bottom 0.813: K4.O 72.07,29.53 72.07,6.35 73.34,5.08 K_4_C.1
N$20
  Bottom 0.813: K4.S 78.1,29.84 78.1,10.48 83.5,5.08 K_4_NC.1
N$21
  Bottom 0.61: T5.1 85.72,37.3 85.72,36.51 86.36,35.88 88.27,35.88 89.85,34.29 R5.2
N$22
  Bottom 0.61: K5.2 86.74,23.43 84.14,26.04 84.14,41.91 84.45,42.23 90.17,42.23 90.8,41.59 90.8,38.24 D5.A 90.34,38.42 T5.3
N$23
  Bottom 0.813: K5.P 92.71,6.03 93.66,5.08 K_5_IN.1
N$24
  Bottom 0.813: K5.O 90.17,29.21 90.17,6.03 89.22,5.08 K_5_C.1
N$25
  Bottom 0.813: K5.S 96.2,30.16 96.2,7.62 98.74,5.08 K_5_NC.1
N$26
  Bottom 0.61: R6.2 108.14,34.1 106.36,35.88 104.14,35.88 103.5,36.51 103.5,37.3 T6.1
N$27
  Bottom 0.61: K6.2 104.52,26.29 101.6,29.21 101.6,41.91 101.92,42.23 107.95,42.23 108.27,41.91 108.27,38.27 D6.A 108.12,38.42 T6.3
N$28
  Bottom 0.813: K6.P 107,14.92 107,6.99 108.9,5.08 K_6_IN.1
N$29
  Bottom 0.813: K6.O 107.63,29.53 107.63,18.41 105.41,16.19 105.41,6.03 104.46,5.08 K_6_C.1
N$30
  Bottom 0.813: K6.S 113.82,30 113.66,29.84 112.39,28.57 112.39,16.19 111.12,14.92 109.54,14.92 108.58,13.97 108.58,9.84 113.35,5.08 K_6_NC.1
N$35
  Bottom 0.61: T7.1 17.46,111.95 R7.2
N$36
  Bottom 0.61: D7.A 21.91,106.53 T7.3 17.32,106.53 13.65,102.87 13.65,90.17 14.8,89.03 K7.2
N$37
  Bottom 0.813: K_1_IN1.1 21.59,82.55 K7.P
N$38
  Bottom 0.813: K_1_C1.1 17.78,81.28 17.78,99.06 K7.O
N$39
  Bottom 0.813: K_1_NC1.1 25.08,84.14 25.08,98.74 K7.S
N$40
  Bottom 0.61: T8.1 R8.2
N$41
  Bottom 0.61: T8.3 39.69,106.22 D8.A
  Bottom 0.813: K8.2 31.43,91 31.43,103.82 33.66,106.05 35.71,106.05 T8.3
N$42
  Bottom 0.813: K_2_IN1.1 44.45,81.92 K8.P
N$43
  Bottom 0.813: K_2_C1.1 35.56,78.74 35.56,99.06 K8.O
N$44
  Bottom 0.813: K_2_NC1.1 49.53,80.96 42.86,87.63 42.86,98.74 K8.S
N$45
  Bottom 0.61: T9.1 52.71,110.36 R9.2
N$46
  Bottom 0.61: D9.A 57.47,105.9 T9.3 50.34,105.9 48.9,104.46 48.9,91.31 K9.2
N$47
  Bottom 0.813: K_3_IN1.1 59.69,84.46 K9.P
N$48
  Bottom 0.813: K_3_C1.1 54.61,97.79 K9.O
N$49
  Bottom 0.813: K_3_NC1.1 64.77,83.19 60.96,87 60.96,99.06 K9.S
N$50  (via drill 0.6 pad 1.68)
  Top 0.406: R12.1 108.45,50.61 v107.95,51.12 104.64,51.12 R11.2
  Bottom 0.61: v107.95,51.12 3V3.1
N$51
  Bottom 0.61: T10.1 70.99,108.23 70.99,110.49 R10.2
N$52
  Bottom 0.61: D11.A 72.24,105.73 T10.3 67.8,105.9 66.36,104.46 66.36,91.63 K10.2
N$53
  Bottom 0.813: K_4_IN1.1 K10.P
N$54
  Bottom 0.813: 12V.1 17.78,11.11 D10.A
N$55
  Bottom 0.813: K_4_C1.1 69.85,84.14 71.44,85.73 71.44,98.74 K10.O
N$56
  Bottom 0.813: K_4_NC1.1 80.01,84.77 78.1,86.68 78.1,98.43 K10.S
N$57
  Bottom 0.61: T11.1 R13.2
N$58
  Bottom 0.61: D12.A 112.71,106.22 T11.3 99.86,106.22 97.47,103.82 84.77,103.82 83.82,102.87 83.82,91.95 K11.2
N$59
  Bottom 0.813: K_5_IN1.1 90.17,80.33 92.71,82.87 K11.P
N$60
  Bottom 0.813: K_5_C1.1 85.09,80.33 89.85,85.09 89.85,98.11 K11.O
N$61  (via drill 0.6 pad 1.68)
  Top 0.406: IC3.7 57.31,50.63 v56.83,51.12 56.65,51.3 C15.1
  Bottom 0.61: v56.83,51.12 59.37,51.12 Q1.2
N$62
  Bottom 0.813: K11.S 95.25,97.79 K_5_NC1.1
N$63
  Bottom 0.61: T12.1 121.6,107.19 R14.2
N$64
  Bottom 0.61: T12.3 D13.A 123.65,98.57 125.73,100.65 125.73,107.95 124.78,108.9 116.2,108.9 115.25,107.95 115.25,104.14 114.62,103.51 108.27,103.51 107,104.78 102.55,104.78 101.28,103.51 101.28,95.89 96.84,91.44 96.84,86.04 97.47,85.41 103.5,85.41 104.46,86.36 104.46,88.96 K12.2
N$65
  Bottom 0.813: K_6_IN1.1 105.41,78.11 110.49,83.19 K12.P
N$66
  Bottom 0.813: K_6_C1.1 100.33,78.11 107.31,85.09 107.31,98.43 K12.O
N$67
  Bottom 0.813: K_6_NC1.1 110.49,79.06 113.98,82.55 113.98,98.74 K12.S
N$79  (via drill 0.6 pad 1.68)
  Top 0.406: IC3.8 65.71,49.84 63.82,47.94 63.82,46.67 v65.4,45.09 64.13,46.35
  Top 0.61: C16.1 57.15,47.31 59.37,45.09 v65.4,45.09
  Bottom 0.61: Q1.1 62.87,47.62 v65.4,45.09
REL_7  (via drill 0.6 pad 1.68)
  Top 0.61: v44.77,115.57 26.67,115.57 v23.18,112.08
  Bottom 0.61: U$3.P$2 89.53,117.48 88.58,118.43 47.62,118.43 v44.77,115.57 | v23.18,112.08 R7.1
REL_8
  Bottom 0.61: U$3.P$3 92.07,118.11 90.8,119.38 40.83,119.38 R8.1
REL_9  (via drill 0.6 pad 1.68)
  Top 0.61: v104.77,116.21 104.77,113.98 100.96,110.17 68.26,110.17 v64.77,113.67
  Bottom 0.61: U$3.P$4 94.61,117.48 95.57,118.43 102.55,118.43 v104.77,116.21 | v64.77,113.67 52.89,113.67 R9.1
REL_10  (via drill 0.6 pad 1.68)
  Top 0.61: v79.38,111.76 100.33,111.76 102.23,113.67 v102.23,115.89
  Bottom 0.61: R10.1 77.66,113.48 v79.38,111.76 | v102.23,115.89 102.23,116.21 101.6,116.84 U$3.P$5
REL_11
  Bottom 0.61: U$3.P$6 101.92,114.3 103.19,113.03 107.5,113.03 R13.1
REL_12
  Bottom 0.61: U$3.P$7 94.61,113.67 96.52,111.76 117.79,111.76 119.38,110.17 121.79,110.17 R14.1
RELAY_1  (via drill 0.6 pad 1.68)
  Top 0.406: IC3.12 69.02,45.21 67.31,43.5 61.91,43.5 56.52,38.1 46.99,38.1 43.81,41.27 39.37,41.27 38.1,40.01 38.1,38.42 37.15,37.46 30.48,37.46 v27.62,40.32
  Bottom 0.61: v27.62,40.32 27.62,38.1 24.45,34.92 R1.1
RELAY_2  (via drill 0.6 pad 1.68)
  Top 0.406: IC3.13 69.82,44.74 67.63,42.55 62.23,42.55 56.83,37.15 44.77,37.15 v42.23,39.69
  Bottom 0.61: R2.1 41.91,33.97 43.18,35.24 43.18,38.73 v42.23,39.69
RELAY_3  (via drill 0.6 pad 1.68)
  Top 0.406: v63.5,39.69 66.99,39.69 70.62,43.32 IC3.14
  Bottom 0.61: R3.1 60.33,33.97 63.5,37.15 v63.5,39.69
RELAY_4  (via drill 0.6 pad 1.68)
  Top 0.406: v80.33,40.01 73.66,40.01 71.42,42.24 IC3.15
  Bottom 0.61: R4.1 77.79,34.29 80.33,36.83 v80.33,40.01
RELAY_5  (via drill 0.6 pad 1.68)
  Top 0.406: v98.42,40.96 96.84,42.55 73.66,42.55 72.22,43.98 IC3.16
  Bottom 0.61: R5.1 95.57,34.29 98.42,37.15 v98.42,40.96
RELAY_6  (via drill 0.6 pad 1.68)
  Top 0.406: 74.61,45.62 IC3.19 74.62,44.44 75.56,43.5 112.39,43.5 v115.57,40.32 114.93,40.96
  Bottom 0.61: R6.1 111.76,34.29 115.57,38.1 v115.57,40.32
RELAY_7  (via drill 0.6 pad 1.68)
  Top 0.406: IC3.31 81.46,53.84 v83.18,55.56
  Bottom 0.406: 82.87,55.56 v83.18,55.56 83.18,58.1 85.09,60.01 88.58,60.01 89.53,59.05 U$1.P$2
RELAY_8  (via drill 0.6 pad 1.68)
  Top 0.406: IC3.30 83.17,53.03 v83.18,53.02
  Bottom 0.406: U$1.P$3 92.07,60.32 91.44,60.96 84.14,60.96 81.6,58.42 81.6,53.67 82.23,53.03 83.17,53.03 v83.18,53.02
RELAY_9  (via drill 0.6 pad 1.68)
  Top 0.406: 90.47,49.84 v90.8,50.16 89.22,48.58 81.28,48.58 80.02,49.84 IC3.26
  Bottom 0.406: v90.8,50.16 93.34,52.7 93.34,57.15 U$1.P$4
RELAY_10  (via drill 0.6 pad 1.68)
  Top 0.406: v97.79,50.16 97.79,47.94 96.52,46.67 80.33,46.67 79.56,47.44 IC3.23
  Bottom 0.406: U$1.P$5 99.69,58.42 100.65,57.47 100.65,53.02 v97.79,50.16
RELAY_11  (via drill 0.6 pad 1.68)
  Top 0.406: v95.57,50.16 95.57,48.58 94.3,47.31 80.64,47.31 79.72,48.23 IC3.24
  Bottom 0.406: U$1.P$6 97.15,52.7 95.57,51.12 v95.57,50.16
RELAY_12  (via drill 0.6 pad 1.68)
  Top 0.406: v93.34,50.16 91.12,47.94 80.96,47.94 79.87,49.03 IC3.25
  Bottom 0.406: U$1.P$7 94.61,52.39 93.34,51.12 v93.34,50.16
RESET  (via drill 0.6 pad 1.68)
  Top 0.406: v47.62,50.16 48.58,49.21 50.16,49.21 51.44,50.48 51.44,54.93 53.02,56.52 60.33,56.52 63.8,53.03 IC3.4 68.59,53.03 68.9,53.34 68.9,55.56 67.31,57.15 65.72,57.15 60.96,61.91 40.96,61.91 38.87,59.82 R17.2
  Bottom 0.61: v47.62,50.16 U$2.RST
SCK  (via drill 0.6 pad 1.68)
  Top 0.406: IC3.3 63.96,53.84 60.64,57.15 52.7,57.15 50.8,55.24 50.8,52.07 50.16,51.44 46.04,51.44 45.09,50.48 v45.09,50.16
  Bottom 0.406: v45.09,50.16 45.09,49.21 44.13,48.26 40.96,48.26 38.1,51.12 X9.1
  Bottom 0.61: v45.09,50.16 U$2.SCK
WS28_DATA  (via drill 0.6 pad 1.68)
  Top 0.406: IC3.33 80.2,55.44 81.91,57.15 81.91,58.74 83.18,60.01 99.06,60.01 100.33,58.74 100.33,53.66 101.28,52.7 110.17,52.7 v110.49,52.39
  Bottom 0.61: v110.49,52.39 SDO.1

### Text on the board
Top: jTech | RELAY MODULE | RELAY MODULE | jTech